# EAGLE schematic SINS (EAGLE 9.4.2)
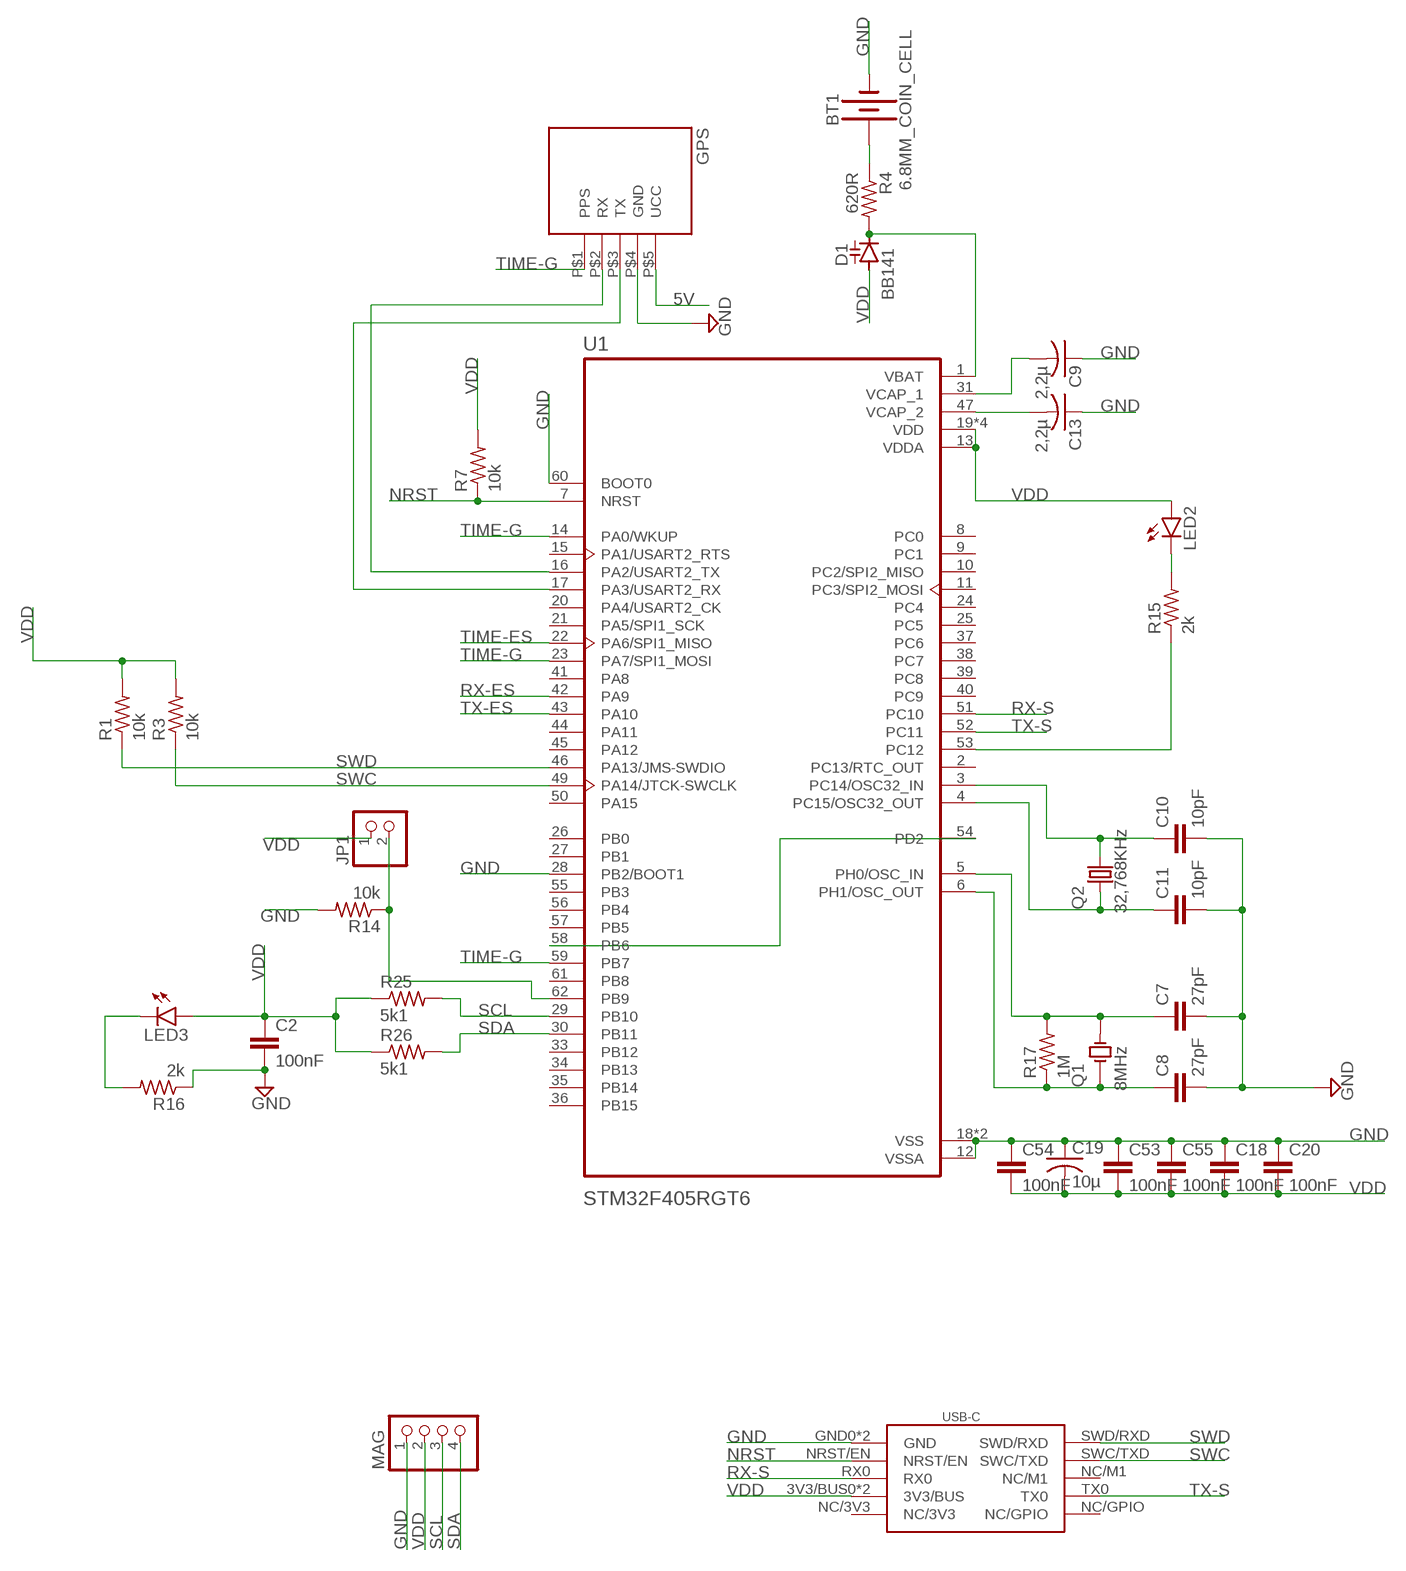
[diagram p0: schematic, sheet 1]

## Parts
BT1  6.8MM_COIN_CELL  BATTERY-6.8MM_SMD  [BATTCON-6.8MM]
C2  100nF  C-EUC0603  [C0603]
C7  27pF  C-EUC0603  [C0603]
C8  27pF  C-EUC0603  [C0603]
C9  2,2µ  C-USC0603  [C0603]
C10  10pF  C-EUC0603  [C0603]
C11  10pF  C-EUC0603  [C0603]
C13  2,2µ  C-USC0603  [C0603]
C18  100nF  C-EUC0603  [C0603]
C19  10µ  C-USC1206  [C1206]
C20  100nF  C-EUC0603  [C0603]
C53  100nF  C-EUC0603  [C0603]
C54  100nF  C-EUC0603  [C0603]
C55  100nF  C-EUC0603  [C0603]
D1  BB141  [SOD523]
GPS  GPSNEO6M  [GPS-NEO6M]
JP1  PINHD-1X2  [1X02]
LED2  LEDCHIPLED_0603  [CHIPLED_0603]
LED3  LEDCHIPLED_0603  [CHIPLED_0603]
MAG  PINHD-1X4  [1X04]
Q1  8MHz  9C-8.000MEEJ-T  [XTAL_9C-8.000MEEJ-T]
Q2  32,768KHz  C005R  [C005R]
R1  10k  R-US_R0603  [R0603]
R3  10k  R-US_R0603  [R0603]
R4  620R  R-US_R0603  [R0603]
R7  10k  R-US_R0603  [R0603]
R14  10k  R-US_R0603  [R0603]
R15  2k  R-US_R0603  [R0603]
R16  2k  R-US_R0603  [R0603]
R17  1M  R-US_R0603  [R0603]
R25  5k1  R-US_R0603  [R0603]
R26  5k1  R-US_R0603  [R0603]
U1  STM32F405RGT6  [QFP50P1200X1200X160-64N]
U$4  USB-C  [USB-C]

## Nets
5V: GPS.P$5(UCC)
GND: BT1.- C2.2 C7.2 C8.2 C9.1 C10.2 C11.2 C13.1 C18.1 C19.1 C20.1 C53.1 C54.1 C55.1 GPS.P$4(GND) MAG.1 R14.2 R16.1 U1.12(VSSA) U1.18(VSS) U1.28(PB2/BOOT1) U1.60(BOOT0) U1.63(VSS) U$4.GND0(GND) U$4.GND1(GND)
N$1: BT1.+ R4.1
N$2: D1.C R4.2 U1.1(VBAT)
N$5: JP1.2 R14.1 U1.62(PB9)
N$6: U1.54(PD2) U1.58(PB6)
N$7: C9.2 U1.31(VCAP_1)
N$8: C13.2 U1.47(VCAP_2)
N$15: C8.1 Q1.1 R17.1 U1.6(PH1/OSC_OUT)
N$30: C7.1 Q1.2 R17.2 U1.5(PH0/OSC_IN)
N$34: C10.1 Q2.P$2 U1.3(PC14/OSC32_IN)
N$35: C11.1 Q2.P$1 U1.4(PC15/OSC32_OUT)
N$37: LED2.C R15.2
N$38: R15.1 U1.53(PC12)
N$40: LED3.C R16.2
N$41: GPS.P$2(RX) U1.16(PA2/USART2_TX)
N$42: GPS.P$3(TX) U1.17(PA3/USART2_RX)
NRST: R7.1 U1.7(NRST) U$4.NRST/EN
RX-ES: U1.42(PA9)
RX-S: U1.51(PC10) U$4.RX0
SCL: MAG.3 R25.2 U1.29(PB10)
SDA: MAG.4 R26.2 U1.30(PB11)
SWC: R3.1 U1.49(PA14/JTCK-SWCLK) U$4.SWC/TXD
SWD: R1.1 U1.46(PA13/JMS-SWDIO) U$4.SWD/RXD
TIME-ES: U1.22(PA6/SPI1_MISO)
TIME-G: GPS.P$1(PPS) U1.14(PA0/WKUP) U1.23(PA7/SPI1_MOSI) U1.59(PB7)
TX-ES: U1.43(PA10)
TX-S: U1.52(PC11) U$4.TX0
VDD: C2.1 C18.2 C19.2 C20.2 C53.2 C54.2 C55.2 D1.A JP1.1 LED2.A LED3.A MAG.2 R1.2 R3.2 R7.2 R25.1 R26.1 U1.13(VDDA) U1.19(VDD) U1.32(VDD) U1.48(VDD) U1.64(VDD) U$4.3V3/BUS0(3V3/BUS) U$4.3V3/BUS1(3V3/BUS)
Unconnected: U1.2(PC13/RTC_OUT) U1.8(PC0) U1.9(PC1) U1.10(PC2/SPI2_MISO) U1.11(PC3/SPI2_MOSI) U1.15(PA1/USART2_RTS) U1.20(PA4/USART2_CK) U1.21(PA5/SPI1_SCK) U1.24(PC4) U1.25(PC5) U1.26(PB0) U1.27(PB1) U1.33(PB12) U1.34(PB13) U1.35(PB14) U1.36(PB15) U1.37(PC6) U1.38(PC7) U1.39(PC8) U1.40(PC9) U1.41(PA8) U1.44(PA11) U1.45(PA12) U1.50(PA15) U1.55(PB3) U1.56(PB4) U1.57(PB5) U1.61(PB8) U$4.NC/3V3 U$4.NC/GPIO U$4.NC/M1

## Library data of the parts
BT1 = SparkFun-Batteries:BATTERY: Battery - Single Cell A variety of battery chemistries, sizes, and footprints. Device List: 20MM_PTH - Coin Cell Battery Holder - 20mm (PTH) <https://www.sparkfun.com/products/783> 20MM_PTH_KIT- Coin Cell battery Holder - 20 mm (PTH) <http://www.sparkfun.com/products/783>kit version with special mask 6.8MM_PTH - Coin Cell Battery Holder - 6.8MM(SMD) <https://www.digikey.com/product-detail/en/seiko-instruments/MS621FE-FL11E/728-1057-ND/1889208?WT.srch=1&gclid=CNOQ5a6LzdQCFZS2wAodXCkE0g> 12MM_SMD - Coin Cell Battery Holder - 12mm (SMD) <https://www.sparkfun.com/products/10592> 12MM_PTH - Coin Cell Battery Holder - 12mm (PTH) <https://www.sparkfun.com/products/7948> 20MM_SMD - 20mm Coin Cell Battery Holder (SMD) (2 legs) Used on the Big Time Watch Kit <https://www.sparkfun.com/products/11734> 20MM_SMD_4LEGS - Coin Cell Battery Holder - 20mm (SMD) <https://www.sparkfun.com/products/11892> 20MM_SMD_4LEGS_OVERPASTE - Coin Cell Battery Holder - 20mm (SMD) <https://www.sparkfun.com/products/11892> (Over-paste on the legs) 24.5MM_PTH - Coin Cell Battery Holder - 24.5mm (PTH) <https://www.sparkfun.com/products/8863> 9V - 9V Battery Holder - PC Mount Used on the SparkFun SparkPunk Sound Kit <https://www.sparkfun.com/products/11177> and SparkFun SparkPunk Sequencer Kit <https://www.sparkfun.com/products/12707> 18650 - Battery Holder - 18650 (PTH) <https://www.sparkfun.com/products/13113> AA - Battery Holder - 1xAA (PTH) <https://www.sparkfun.com/products/7949> AAA - Battery Holder - 1xAAA (PTH) <https://www.sparkfun.com/products/12718> AA_KIT - Battery Holder - 1xAA (PTH) <https://www.sparkfun.com/products/7949> Special kit package - pads only have exposed copper on one side of the board. AAA_KIT - Battery Holder - 1xAAA (PTH) <https://www.sparkfun.com/products/12718> Special kit package - pads only have exposed copper on one side of the board.; PROD_ID: BATT-13734
C2 C7 C8 C10 C11 C18 C20 C53-C55 = rcl:C-EU: CAPACITOR, European symbol; SPICEPREFIX: C
C9 C13 C19 = rcl:C-US: CAPACITOR, American symbol; SPICEPREFIX: C
D1 = diode:BB141: Capacity DIODE variable-capacitance diode
GPS = CanCubeSat:GPS
JP1 = pinheadCS:PINHD-1X2: PIN HEADER
LED2 LED3 = led:LED: LED OSRAM: - CHIPLED LG R971, LG N971, LY N971, LG Q971, LY Q971, LO R971, LY R971 LH N974, LH R974 LS Q976, LO Q976, LY Q976 LO Q996 - Hyper CHIPLED LW Q18S LB Q993, LB Q99A, LB R99A - SideLED LS A670, LO A670, LY A670, LG A670, LP A670 LB A673, LV A673, LT A673, LW A673 LH A674 LY A675 LS A676, LA A676, LO A676, LY A676, LW A676 LS A679, LY A679, LG A679 - Hyper Micro SIDELED® LS Y876, LA Y876, LO Y876, LY Y876 LT Y87S - SmartLED LW L88C, LW L88S LB L89C, LB L89S, LG L890 LS L89K, LO L89K, LY L89K LS L896, LA L896, LO L896, LY L896 - TOPLED LS T670, LO T670, LY T670, LG T670, LP T670 LSG T670, LSP T670, LSY T670, LOP T670, LYG T670 LG T671, LOG T671, LSG T671 LB T673, LV T673, LT T673, LW T673 LH T674 LS T676, LA T676, LO T676, LY T676, LB T676, LH T676, LSB T676, LW T676 LB T67C, LV T67C, LT T67C, LS T67K, LO T67K, LY T67K, LW E67C LS E67B, LA E67B, LO E67B, LY E67B, LB E67C, LV E67C, LT E67C LW T67C LS T679, LY T679, LG T679 LS T770, LO T770, LY T770, LG T770, LP T770 LB T773, LV T773, LT T773, LW T773 LH T774 LS E675, LA E675, LY E675, LS T675 LS T776, LA T776, LO T776, LY T776, LB T776 LHGB T686 LT T68C, LB T68C - Hyper Mini TOPLED® LB M676 - Mini TOPLED Santana® LG M470 LS M47K, LO M47K, LY M47K Source: http://www.osram.convergy.de LUXEON: - LUMILED® LXK2-PW12-R00, LXK2-PW12-S00, LXK2-PW14-U00, LXK2-PW14-V00 LXK2-PM12-R00, LXK2-PM12-S00, LXK2-PM14-U00 LXK2-PE12-Q00, LXK2-PE12-R00, LXK2-PE12-S00, LXK2-PE14-T00, LXK2-PE14-U00 LXK2-PB12-K00, LXK2-PB12-L00, LXK2-PB12-M00, LXK2-PB14-N00, LXK2-PB14-P00, LXK2-PB14-Q00 LXK2-PR12-L00, LXK2-PR12-M00, LXK2-PR14-Q00, LXK2-PR14-R00 LXK2-PD12-Q00, LXK2-PD12-R00, LXK2-PD12-S00 LXK2-PH12-R00, LXK2-PH12-S00 LXK2-PL12-P00, LXK2-PL12-Q00, LXK2-PL12-R00 Source: www.luxeon.com KINGBRIGHT: KA-3528ASYC Source: www.kingbright.com
MAG = pinheadCS:PINHD-1X4: PIN HEADER
Q1 = 9C-8.000MEEJ-T:9C-8.000MEEJ-T: Crystal, 8mhz, 18pf, Hc-49s; AVAILABILITY: Unavailable; DESCRIPTION: Crystal, 8mhz, 18pf, Hc-49s; MF: TXC CORPORATION; MP: 9C-8.000MEEJ-T; PACKAGE: HC49/US TXC; PRICE: None
Q2 = CanCubeSat:C005R
R1 R3 R4 R7 R14-R17 R25 R26 = resistor:R-US_: RESISTOR, American symbol
U1 = STM32F405RGT6:STM32F405RGT6: High-performance foundation line, ARM Cortex-M4 core with DSP and FPU, 1 Mbyte Flash, 168 MHz CPU, ART Accelerator; DESCRIPTION: High-performance foundation line, ARM Cortex-M4 core with DSP and FPU, 1 Mbyte Flash, 168 MHz CPU, ART Accelerator; DIGI-KEY_PART_NUMBER: 497-11767-ND; DIGI-KEY_PURCHASE_URL: https://www.digikey.com/product-detail/en/stmicroelectronics/STM32F405RGT6/497-11767-ND/2754208?utm_source=snapeda&utm_medium=aggregator&utm_campaign=symbol; MF: STMicroelectronics; MP: STM32F405RGT6; PACKAGE: LQFP-64 STMicroelectronics
U$4 = CanCubeSat:USB-C